# EAGLE design Spectra6PCB_71 (EAGLE 9.6.2)
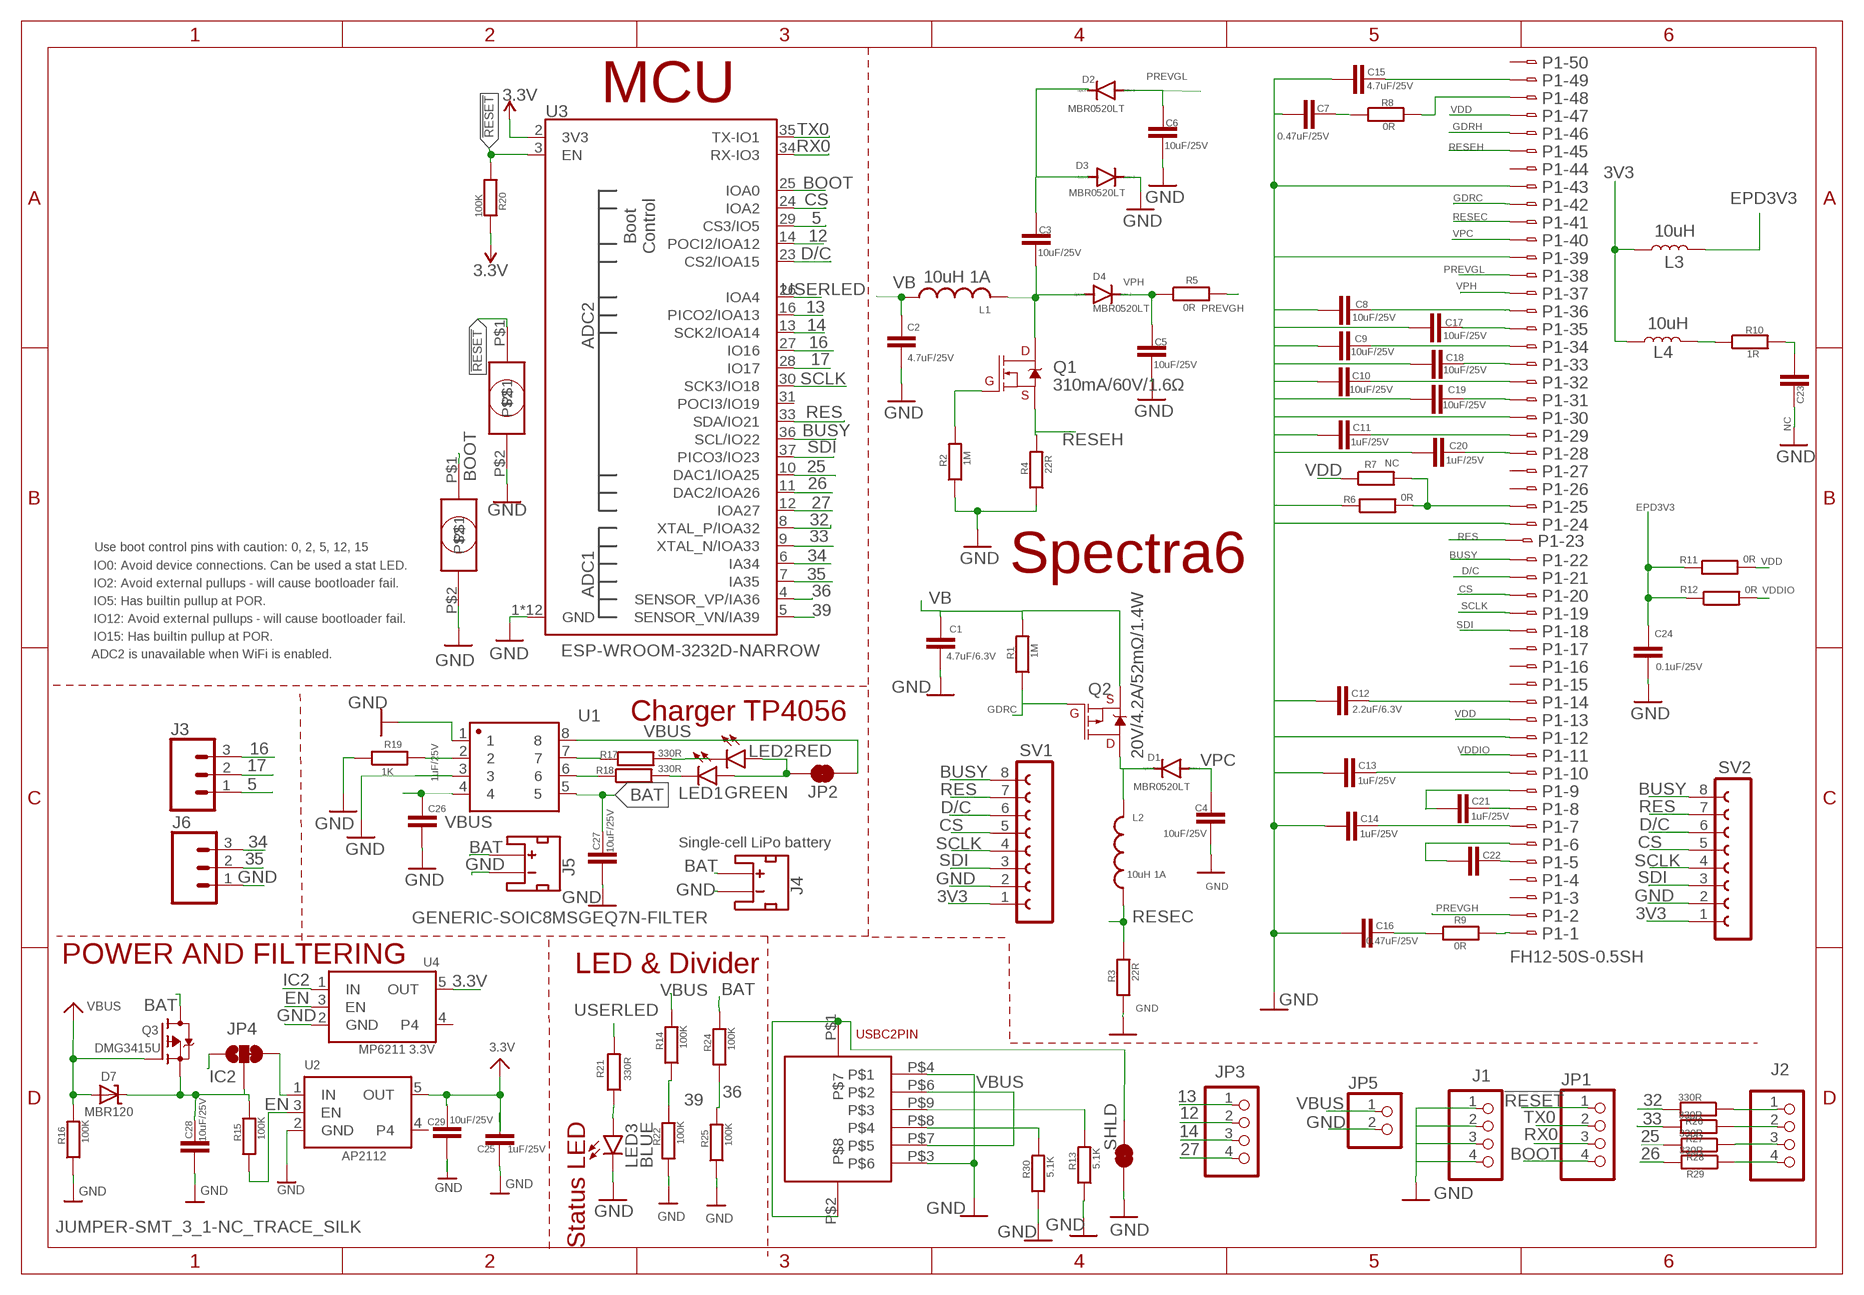
[diagram p0: schematic, sheet 1]

## Parts
C1  4.7uF/6.3V  C-EUC0805  [C0805]
C2  4.7uF/25V  C-EUC0805  [C0805]
C3  10uF/25V  C-EUC0805  [C0805]
C4  10uF/25V  C-EUC0805  [C0805]
C5  10uF/25V  C-EUC0805  [C0805]
C6  10uF/25V  C-EUC0805  [C0805]
C7  0.47uF/25V  C-EUC0805  [C0805]
C8  10uF/25V  C-EUC0805  [C0805]
C9  10uF/25V  C-EUC0805  [C0805]
C10  10uF/25V  C-EUC0805  [C0805]
C11  1uF/25V  C-EUC0805  [C0805]
C12  2.2uF/6.3V  C-EUC0805  [C0805]
C13  1uF/25V  C-EUC0805  [C0805]
C14  1uF/25V  C-EUC0805  [C0805]
C15  4.7uF/25V  C-EUC0805  [C0805]
C16  0.47uF/25V  C-EUC0805  [C0805]
C17  10uF/25V  C-EUC0805  [C0805]
C18  10uF/25V  C-EUC0805  [C0805]
C19  10uF/25V  C-EUC0805  [C0805]
C20  1uF/25V  C-EUC0805  [C0805]
C21  1uF/25V  C-EUC0805  [C0805]
C22  1uF/25V  C-EUC0805  [C0805]
C23  NC  C-EUC0805  [C0805]
C24  0.1uF/25V  C-EUC0805  [C0805]
C25  1uF/25V  C-EUC0805  [C0805]
C26  1uF/25V  C-EUC0805  [C0805]
C27  10uF/25V  C-EUC0805  [C0805]
C28  10uF/25V  C-EUC0805  [C0805]
C29  10uF/25V  C-EUC0805  [C0805]
D1  MBR0520LT  [SOD123]
D2  MBR0520LT  [SOD123]
D3  MBR0520LT  [SOD123]
D4  MBR0520LT  [SOD123]
D7  MBR120  DIODE-SCHOTTKYSOD-123  [SOD-123]
J1  PINHD-1X4  [1X04]
J2  PINHD-1X4  [1X04]
J3  CONN_03PAD  [1X03_SOLDER_PADS]
J4  JST_2MM_MALE  [JST-2-SMD]
J5  NC  JST_2MM_MALE  [JST-2-SMD]
J6  CONN_03PAD  [1X03_SOLDER_PADS]
JP1  PINHD-1X4  [1X04]
JP2  JUMPER-SMT_2_NC_TRACE_SILK  [SMT-JUMPER_2_NC_TRACE_SILK]
JP3  PINHD-1X4  [1X04]
JP4  JUMPER-SMT_3_1-NC_TRACE_SILK  [SMT-JUMPER_3_1-NC_TRACE_SILK]
JP5  PINHD-1X2  [1X02]
L1  10uH 1A  L-USL4035M  [L4035M]
L2  10uH 1A  L-USL4035M  [L4035M]
L3  10uH  INDUCTOR-0805-3.3UH  [0805]
L4  10uH  INDUCTOR-0805-3.3UH  [0805]
LED1  GREEN  LEDSML0805  [SML0805]
LED2  RED  LEDSML0805  [SML0805]
LED3  BLUE  LEDSML0805  [SML0805]
P1  FH12-50S-0.5SH  [FH12-50S-0.5SH]
Q1  310mA/60V/1.6Ω  MOSFET-NCH-2N7002PW  [SOT323]
Q2  20V/4.2A/52mΩ/1.4W  MOSFET_PCH-DMG2305UX-7  [SOT23-3]
Q3  DMG3415U  MOSFET-P  [SOT23-R]
R1  1M  R-EU_M0805  [M0805]
R2  1M  R-EU_M0805  [M0805]
R3  22R  R-EU_M0805  [M0805]
R4  22R  R-EU_M0805  [M0805]
R5  0R  R-EU_M0805  [M0805]
R6  0R  R-EU_M0805  [M0805]
R7  NC  R-EU_M0805  [M0805]
R8  0R  R-EU_M0805  [M0805]
R9  0R  R-EU_M0805  [M0805]
R10  1R  R-EU_M0805  [M0805]
R11  0R  R-EU_M0805  [M0805]
R12  0R  R-EU_M0805  [M0805]
R13  5.1K  R-EU_M0805  [M0805]
R14  100K  R-EU_M0805  [M0805]
R15  100K  R-EU_M0805  [M0805]
R16  100K  R-EU_M0805  [M0805]
R17  330R  R-EU_M0805  [M0805]
R18  330R  R-EU_M0805  [M0805]
R19  1K  R-EU_M0805  [M0805]
R20  100K  R-EU_M0805  [M0805]
R21  330R  R-EU_M0805  [M0805]
R22  100K  R-EU_M0805  [M0805]
R24  100K  R-EU_M0805  [M0805]
R25  100K  R-EU_M0805  [M0805]
R26  330R  R-EU_M0805  [M0805]
R27  330R  R-EU_M0805  [M0805]
R28  330R  R-EU_M0805  [M0805]
R29  330R  R-EU_M0805  [M0805]
R30  5.1K  R-EU_M0805  [M0805]
S3  TACTILE  [TACTILE]
S4  TACTILE  [TACTILE]
SHLD  SHLD  JUMPER-SMT_2_NC_TRACE_NO-SILK  [SMT-JUMPER_2_NC_TRACE_NO-SILK]
SV1  FE08-1  [FE08]
SV2  FE08-1  [FE08]
U1  GENERIC-SOIC8MSGEQ7N-FILTER  [SO08]
U2  AP2112  VREG_SOT23-5  [SOT23-5]
U3  ESP-WROOM-3232D-NARROW  [ESP-WROOM-32D-NARROW]
U4  MP6211 3.3V  VREG_SOT23-5  [SOT23-5]
U$4  USBC6PIN  [USBC6PIN]

## Nets
3.3V: C25.2 C29.2 R20.2 U2.5(OUT) U3.2(3V3) U4.5(OUT)
3V3: L3.1 L4.1 SV1.1 SV2.1
5: J3.1 U3.29(CS3/IO5)
12: JP3.2 U3.14(POCI2/IOA12)
13: JP3.1 U3.16(PICO2/IOA13)
14: JP3.3 U3.13(SCK2/IOA14)
16: J3.3 U3.27(IO16)
17: J3.2 U3.28(IO17)
25: R28.2 U3.10(DAC1/IOA25)
26: R29.2 U3.11(DAC2/IOA26)
27: JP3.4 U3.12(IOA27)
32: R26.2 U3.8(XTAL_P/IOA32)
33: R27.2 U3.9(XTAL_N/IOA33)
34: J6.3 U3.6(IA34)
35: J6.2 U3.7(IA35)
36: R24.1 R25.2 U3.4(SENSOR_VP/IA36)
39: R14.1 R22.2 U3.5(SENSOR_VN/IA39)
!RESET!: JP1.1 R20.1 S4.P$1 U3.3(EN)
BAT: C27.2 J4.2(+) J5.2(+) Q3.3(D) R24.2 U1.5
BOOT: JP1.4 S3.P$1 U3.25(IOA0)
BUSY: P1.22 SV1.8 SV2.8 U3.36(SCL/IO22)
CS: P1.20 SV1.5 SV2.5 U3.24(IOA2)
D/C: P1.21 SV1.6 SV2.6 U3.23(CS2/IOA15)
EN: R15.1 U2.3(EN) U4.3(EN)
EPD3V3: C24.2 L3.2 R11.1 R12.1
GDRC: P1.42 Q2.1(G) R1.1
GDRH: P1.46 Q1.1(G) R2.2
GND: C1.1 C2.1 C4.1 C5.2 C6.2 C7.1 C8.1 C9.1 C10.1 C11.1 C12.1 C13.1 C14.1 C15.1 C16.1 C17.1 C18.1 C19.1 C20.1 C23.2 C24.1 C25.1 C26.1 C27.1 C28.1 C29.1 D3.C J1.1 J1.2 J1.3 J1.4 J4.1(-) J5.1(-) J6.1 JP5.2 LED3.C P1.24 P1.30 P1.39 P1.43 R2.1 R3.1 R4.1 R6.1 R13.1 R16.1 R19.1 R22.1 R25.1 R30.1 S3.P$2 S4.P$2 SHLD.1 SV1.2 SV2.2 U1.1 U1.3 U2.2(GND) U3.1(GND) U3.15(GND) U3.38(GND) U3.GND1(GND) U3.GNDT1(GND) U3.GNDT2(GND) U3.GNDT3(GND) U3.GNDT4(GND) U3.GNDT5(GND) U3.GNDT6(GND) U3.GNDT7(GND) U3.GNDT8(GND) U4.2(GND) U$4.P$3 U$4.P$4
IC2: JP4.1 U4.1(IN)
LED1: LED2.C R17.2
LED2: LED1.C R18.2
N$1: C15.2 P1.49
N$2: P1.48 R8.2
N$3: C7.2 R8.1
N$4: L4.2 R10.1
N$5: C8.2 P1.36
N$6: C17.2 P1.35
N$7: C9.2 P1.34
N$8: C18.2 P1.33
N$9: C10.2 P1.32
N$10: C19.2 P1.31
N$12: C11.2 P1.29
N$13: C20.2 P1.28
N$14: P1.25 R6.2 R7.2
N$15: JP2.2 LED1.A LED2.A
N$16: C12.2 P1.14
N$17: C13.2 P1.10
N$18: C21.1 P1.9
N$19: C21.2 P1.8
N$20: C14.2 P1.7
N$21: C22.1 P1.6
N$22: C22.2 P1.5
N$23: P1.1 R9.2
N$24: C16.2 R9.1
N$25: C3.2 D4.A L1.2 Q1.3(D)
N$26: C3.1 D2.C D3.A
N$27: C23.1 R10.2
N$28: J2.1 R26.1
N$29: P1.12
N$30: J2.2 R27.1
N$31: D1.C L2.2 Q2.3(D)
N$32: J2.3 R28.1
N$33: C1.2 Q2.2(S) R1.2
N$34: R19.2 U1.2
N$35: JP4.3 U2.1(IN)
N$36: C28.2 D7.C JP4.2 Q3.2(S) R15.2
N$37: R18.1 U1.6
N$38: R17.1 U1.7
N$39: LED3.A R21.1
N$40: J2.4 R29.1
N$41: R30.2 U$4.P$8
N$42: R13.2 U$4.P$9
PREVGH: P1.2 R5.2
PREVGL: C6.1 D2.A P1.38
RES: P1.23 SV1.7 SV2.7 U3.33(SDA/IO21)
RESEC: L2.1 P1.41 R3.2
RESEH: P1.45 Q1.2(S) R4.2
RX0: JP1.3 U3.34(RX-IO3)
SCLK: P1.19 SV1.4 SV2.4 U3.30(SCK3/IO18)
SDI: P1.18 SV1.3 SV2.3 U3.37(PICO3/IO23)
SHLD: SHLD.2 U$4.P$1 U$4.P$2
TX0: JP1.2 U3.35(TX-IO1)
USERLED: R21.2 U3.26(IOA4)
VB: C2.2 L1.1
VBUS: C26.2 D7.A JP2.1 JP5.1 Q3.1(G) R14.2 R16.2 U1.4 U1.8 U$4.P$6 U$4.P$7
VDD: P1.13 P1.47 R7.1 R11.2
VDDIO: P1.11 R12.2
VPC: C4.2 D1.A P1.40
VPH: C5.1 D4.C P1.37 R5.1
Unconnected: J4.NC1(PAD1) J4.NC2(PAD2) J5.NC1(PAD1) J5.NC2(PAD2) P1.3 P1.4 P1.15 P1.16 P1.17 P1.26 P1.27 P1.44 P1.50 U2.4 U3.31(POCI3/IO19) U4.4

## Notes on the sheet
- MCU
- Use boot control pins with caution: 0, 2, 5, 12, 15
- IO0: Avoid device connections. Can be used a stat LED.
- Spectra6
- IO2: Avoid external pullups - will cause bootloader fail.
- IO5: Has builtin pullup at POR.
- IO12: Avoid external pullups - will cause bootloader fail.
- IO15: Has builtin pullup at POR.
- ADC2 is unavailable when WiFi is enabled.
- Charger TP4056
- Single-cell LiPo battery
- POWER AND FILTERING
- LED & Divider
- Status LED

## Library data of the parts
C1-C29 = rcl:C-EU: CAPACITOR, European symbol; SPICEPREFIX: C
D1-D4 = diode:MBR0520LT: SCHOTTKY BARRIER RECTIFIER Source: http://onsemi.com .. MBR0520LT1-D.pdf
D7 = microbuilder:DIODE-SCHOTTKY
J1 J2 JP1 JP3 = pinhead:PINHD-1X4: PIN HEADER
J3 J6 = SparkFun-Connectors:CONN_03: Multi connection point. Often used as Generic Header-pin footprint for 0.1 inch spaced/style header connections On any of the 0.1 inch spaced packages, you can populate with these: Break Away Headers - Straight <https://www.sparkfun.com/products/116> (PRT-00116) Break Away Male Headers - Right Angle <https://www.sparkfun.com/products/553> (PRT-00553) Female Headers <https://www.sparkfun.com/products/115> (PRT-00115) Break Away Headers - Machine Pin <https://www.sparkfun.com/products/117> (PRT-00117) Break Away Female Headers - Swiss Machine Pin <https://www.sparkfun.com/products/743> (PRT-00743) Stackable Header - 3 Pin (Female, 0.1") <https://www.sparkfun.com/products/13875> (PRT-13875) For SCREWTERMINALS and SPRING TERMINALS visit here: Screw Terimnals on SparkFun.com <https://www.sparkfun.com/search/results?term=Screw+Terminals> (5mm/3.5mm/2.54mm spacing) This device is also useful as a general connection point to wire up your design to another part of your project. Our various solder wires solder well into these plated through hole pads. Hook-Up Wire - Assortment (Stranded, 22 AWG) <https://www.sparkfun.com/products/11375> (PRT-11375) Hook-Up Wire - Assortment (Solid Core, 22 AWG) <https://www.sparkfun.com/products/11367> (PRT-11367) View the entire wire category on our website here <https://www.sparkfun.com/categories/141> Special notes: Molex polarized connector foot print use with SKU : PRT-08232 with associated crimp pins and housings.
J4 J5 = SparkFun-Connectors:JST_2MM_MALE: JST 2MM MALE RA CONNECTOR Two pin, compact surface mount connector. Commonly used as a battery input connection point. We really like the solid locking feeling and high current rating on these small connectors. We use these all the time as battery connectors. Mates to single-cell LiPo batteries. Here is the connector we sell at SparkFun: JST Right Angle Connector - White <https://www.sparkfun.com/products/8612> (PRT-08612) Datasheet <http://www.sparkfun.com/datasheets/Prototyping/Connectors/JST-Horizontal.pdf> It was used on these SparkFun products: SparkFun MOSFET Power Controller <https://www.sparkfun.com/products/11214> (PRT-11214) SparkFun Battery Babysitter - LiPo Battery Manager <https://www.sparkfun.com/products/13777> (PRT-13777) And many, many others that required a lipo battery connection.; PROD_ID: CONN-11443; SF_ID: PRT-08612
JP2 SHLD = SparkFun-Jumpers:JUMPER-SMT_2_NC_TRACE: Normally closed trace jumper This jumper has a trace between two pads so it's normally closed (NC). Use a razor knife to open the connection. For best results follow the IPC guidelines for cutting traces: Cutout at least 0.063 mm (0.005 in). Remove all loose material to clean up the cut area. Seal the cut with an approved epoxy. Reapply solder to reclose the connection.
JP4 = SparkFun-Jumpers:JUMPER-SMT_3_1-NC_TRACE: Normally closed trace jumper (1 of 2 connections) This jumper has a trace between two pads so it's normally closed (NC). The other connection is normally open (NO). Use a razor knife to open the connection. For best results follow the IPC guidelines for cutting traces: Cutout at least 0.063 mm (0.005 in). Remove all loose material to clean up the cut area. Seal the cut with an approved epoxy. Reapply solder to reclose the connection, or to close the NO connection.
JP5 = pinhead:PINHD-1X2: PIN HEADER
L1 L2 = rcl:L-US: INDUCTOR, American symbol; SPICEPREFIX: L
L3 L4 = SparkFun-Coils:INDUCTOR: Inductors Resist changes in electrical current. Basically a coil of wire. SparkFun Products: SparkFun Load Cell Amplifier - HX711 <https://www.sparkfun.com/products/13879> IOIO-OTG - V2.2 <https://www.sparkfun.com/products/13613>; PROD_ID: NDUC-13076; VALUE: 3.3µH/±20%/450mA
LED1-LED3 = led:LED: LED OSRAM: - CHIPLED LG R971, LG N971, LY N971, LG Q971, LY Q971, LO R971, LY R971 LH N974, LH R974 LS Q976, LO Q976, LY Q976 LO Q996 - Hyper CHIPLED LW Q18S LB Q993, LB Q99A, LB R99A - SideLED LS A670, LO A670, LY A670, LG A670, LP A670 LB A673, LV A673, LT A673, LW A673 LH A674 LY A675 LS A676, LA A676, LO A676, LY A676, LW A676 LS A679, LY A679, LG A679 - Hyper Micro SIDELED® LS Y876, LA Y876, LO Y876, LY Y876 LT Y87S - SmartLED LW L88C, LW L88S LB L89C, LB L89S, LG L890 LS L89K, LO L89K, LY L89K LS L896, LA L896, LO L896, LY L896 - TOPLED LS T670, LO T670, LY T670, LG T670, LP T670 LSG T670, LSP T670, LSY T670, LOP T670, LYG T670 LG T671, LOG T671, LSG T671 LB T673, LV T673, LT T673, LW T673 LH T674 LS T676, LA T676, LO T676, LY T676, LB T676, LH T676, LSB T676, LW T676 LB T67C, LV T67C, LT T67C, LS T67K, LO T67K, LY T67K, LW E67C LS E67B, LA E67B, LO E67B, LY E67B, LB E67C, LV E67C, LT E67C LW T67C LS T679, LY T679, LG T679 LS T770, LO T770, LY T770, LG T770, LP T770 LB T773, LV T773, LT T773, LW T773 LH T774 LS E675, LA E675, LY E675, LS T675 LS T776, LA T776, LO T776, LY T776, LB T776 LHGB T686 LT T68C, LB T68C - Hyper Mini TOPLED® LB M676 - Mini TOPLED Santana® LG M470 LS M47K, LO M47K, LY M47K Source: http://www.osram.convergy.de LUXEON: - LUMILED® LXK2-PW12-R00, LXK2-PW12-S00, LXK2-PW14-U00, LXK2-PW14-V00 LXK2-PM12-R00, LXK2-PM12-S00, LXK2-PM14-U00 LXK2-PE12-Q00, LXK2-PE12-R00, LXK2-PE12-S00, LXK2-PE14-T00, LXK2-PE14-U00 LXK2-PB12-K00, LXK2-PB12-L00, LXK2-PB12-M00, LXK2-PB14-N00, LXK2-PB14-P00, LXK2-PB14-Q00 LXK2-PR12-L00, LXK2-PR12-M00, LXK2-PR14-Q00, LXK2-PR14-R00 LXK2-PD12-Q00, LXK2-PD12-R00, LXK2-PD12-S00 LXK2-PH12-R00, LXK2-PH12-S00 LXK2-PL12-P00, LXK2-PL12-Q00, LXK2-PL12-R00 Source: www.luxeon.com KINGBRIGHT: KA-3528ASYC Source: www.kingbright.com
P1 = con-hirose:FH12-50S-0.5S: 0.5mm Pitch Connectors For FPC/FFC Source: Data sheet <http://www.hirose.co.jp/cataloge_hp/e58605370.pdf>; MPN: FH12-50S-0.5SH(55); OC_FARNELL: 1324557; OC_NEWARK: 34M6181
Q1 = SparkFun-DiscreteSemi:MOSFET-NCH: N-channel MOSFETs Voltage controlled devices that allow control of high current outputs. SparkFun Products: SparkFun OpenScale <https://www.sparkfun.com/products/13261> SparkFun Digital Sandbox <https://www.sparkfun.com/products/12651> SparkFun Monster Moto Shield <https://www.sparkfun.com/products/10182> SparkFun MOSFET Power Controller <https://www.sparkfun.com/products/11214>; PROD_ID: TRANS-11151
Q2 = SparkFun-DiscreteSemi:MOSFET_PCH: P-channel MOSFETs Voltage controlled devices that allow control of high current outputs. SparkFun Products: SparkFun ESP32 Thing <https://www.sparkfun.com/products/13907> SparkFun ESP8266 Thing <https://www.sparkfun.com/products/13231> SparkFun Pi Servo HAT V2 <https://www.sparkfun.com/products/15316> DMG2305UX-7 (20V/4.2A/SOT23-3); PROD_ID: TRANS-14388
Q3 = microbuilder:MOSFET-P: P-Channel Mosfet LEGEND VDS: Voltage Drain-Source ID: Drain Current RDS(ON): Drain-Source On-State Resistance VGS(TH): Gate-Source Threshold Voltage CISS: Drain-Source Input Capacitance SOT-23 Name VDS ID RDS(ON) VGS(TH) CISS Order Number IRLML5103 30V 760mA 600 mOhm -- 75pF @ 25V Digikey: IRLML5103PBFCT-ND IRLML6401 12V 4.3A 50 mOhm 950mV @ 250µA 830pF @ 10V Digikey: IRLML6401PBFTR-ND NTR0202PL 20V 400mA 800 mOhm 2.3V @ 250uA 70pF @ 5V Digikey: NTR0202PLT1GOSTR-ND NTR4101PT1G 20V 1.8A 85 mOhm 1.2V @ 250uA 675pF @ 10V Digikey: NTR4101PT1GOSCT-ND DMP2004K 20V 600mA 900 mOhm 1V @ 250uA 175pF @ 16V Digikey: DMP2004KDICT-ND PMV65XP 20V 3.9A 76 mOhm 950mV @ 1mA 725pF @ 20V Digikey: 568-2358-2-ND TO-252 Name VDS ID RDS(ON) VGS(TH) CISS Order Number AOD417 30V 25A 34 mOhm 3V @ 250µA 920pF @ 15V Digikey: 785-1106-2-ND PowerPak Name VDS ID RDS(ON) VGS(TH) CISS Order Number AON7401 30V 12A 14 mOhm 3V @ 250µA 2600pF @ 15V Digikey: 785-1302-1-ND
R1-R22 R24-R30 = rcl:R-EU_: RESISTOR, European symbol; SPICEPREFIX: R
S3 S4 = TACTILE1:TACTILE
SV1 SV2 = con-lsta:FE08-1: FEMALE HEADER; OC_FARNELL: unknown; OC_NEWARK: unknown
U1 = SparkFun-Retired:GENERIC-SOIC8: A placeholder for generic narrow & wide SOIC8 foorptints - used on the DIP adapter board. Has strange reference to IC-10141, a Seven Band Graphic Equalizer Display Filter SOIC-8 VFP: IC-10141; PROD_ID: IC-10141
U2 U4 = microbuilder:VREG_SOT23-5: SOT23-5 Fixed Voltage Regulators Part Current Out V Out V In V Dropout θJA (°C/W) TJ (°C) Digikey Part No. ADP121 150mA 3.3V 3.4-5.5V 0.09V @ 150mA -- -- ADP121-AUJZ33R7CT-ND ADP121 150mA 3.0V 3.1-5.5V 0.09V @ 150mA -- -- ADP121-AUJZ30R7CT-ND ADP122 300mA 3.3V 3.4-5.5V 0.085V @ 300mA -- -- ADP122AUJZ-3.3-R7CT-ND ADP1712 300mA 3.3V 3.5-5.5V 0.17V @ 300mA -- -- ADP1712AUJZ-3.3-R7TR-ND AP7311 (Low Cost) 150mA 3.3V 3.5-6V 0.15V @ 150mA -- -- AP7311-33WG-7DICT-ND LD39015M18R 150mA 1.8V 1.9V-5.5V 0.08V @ 100mA -- -- 497-6977-1-ND LP2985A-33DBVR 150mA 3.3V 3.3-16V 0.28V @ 150mA 206 150 296-18479-1-ND MCP1824T-3302E/OT 300mA 3.3V 3.5V-6V 0.2V @ 300mA -- -- MCP1824T-3302E/OTCT-ND MIC5205-2.5YM5 TR 150mA 2.5V 2.7-16V 0.165V @ 150mA -- -- 576-1257-2-ND MIC5205-3.0YM5 TR 150mA 3.0V 3.2V-16V 0.165V @ 150mA -- -- 576-1258-2-ND MIC5205-3.3YM5 TR 150mA 3.3V 3.5V-16V 0.165V @ 150mA -- -- 576-1259-2-ND TPS780330220 150mA 3.3V+2.2V 3.6-5.5V 250mV Max -- -- 296-23332-1-ND TDA3663/N1,135 100mA 3.3V 3.5-45V 0.18V @ 50mA -- -- 568-5343-1-ND Max operating temp can be calculated using θJA, TJ (max junction temperature), and power in watts. Set the "Maximum Ambient Temperature" until it reaches TJ ("Max Junction Temperature"), which is the absolute limit for safe use of the regulator: Heat Sink Temperature Calculator <http://www.daycounter.com/Calculators/Heat-Sink-Temperature-Calculator.phtml> For example, With 12V source into a 3.3V LP2985 and a 30mA load, we are dissipating (12V-3.3V) * 0.03A = 0.261W. With a θJA of 206 °C/W, a TJ of 150°C, and 261mW we can safely use the chip without a heat sink up to 75°C (=147.1°C Junction Temperature).
U3 = SparkFun-RF:ESP-WROOM-32: ESP-WROOM-32D - trace antenna (includes keepout) ESP-WROOM-32U - U.FL antenna connector Includes both "standard" footprints and "narrow" version (for use with tighter layouts).; PROD_ID: IC-15676
U$4 = USBC6PIN4:USBC6PIN

## Net classes
0 default: width 0.127 mm, drill 0.305 mm
1 power: width 0.305 mm, drill 0.305 mm

## Board
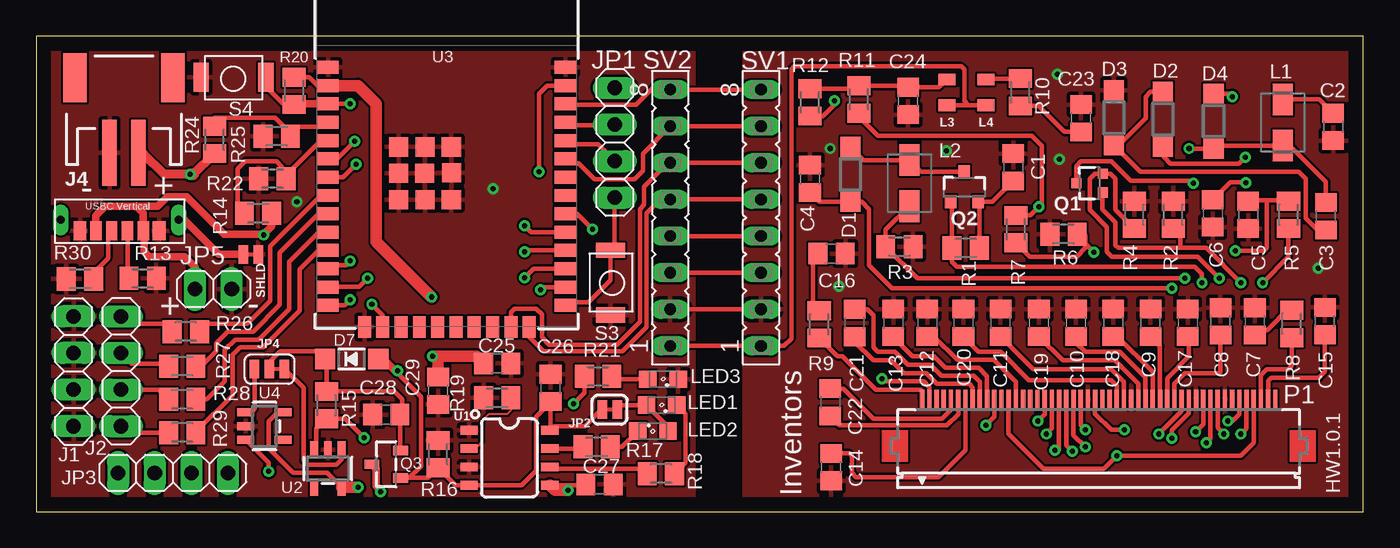
[diagram p1: board, top side]
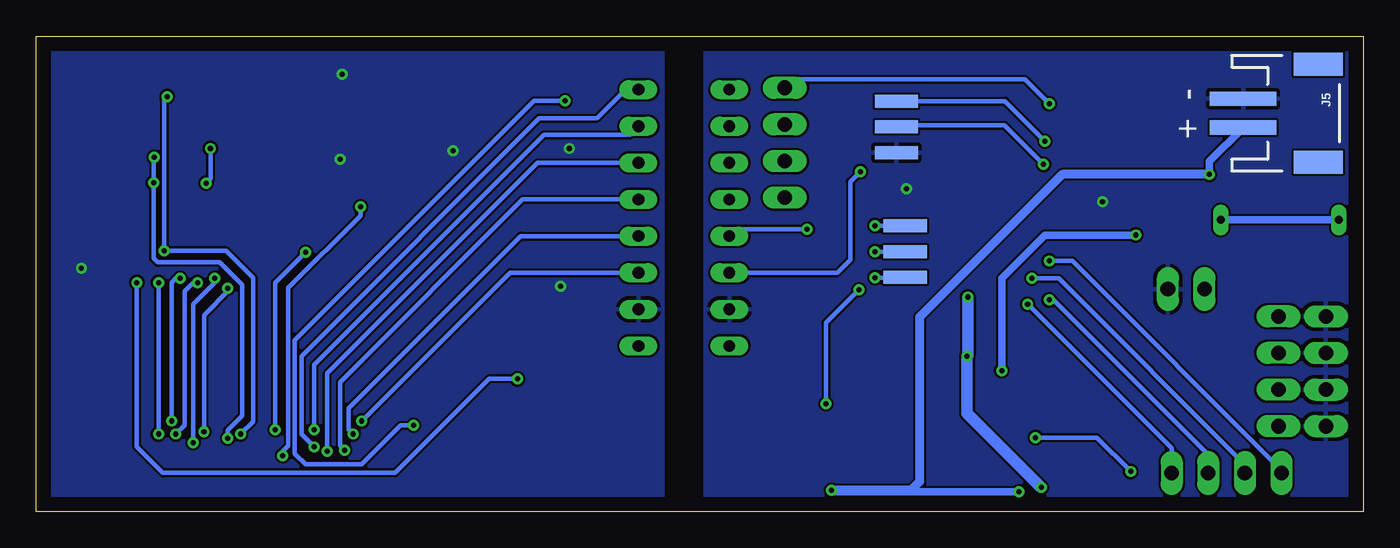
[diagram p2: board, bottom side, seen from below]

Size 92.1 x 33 mm. Coordinates in mm from the lower left corner, seen from the top.
Outline: 0,0 92.1,0 92.1,33 0,33 0,0
Copper layers (1*16): Top 0.035mm / dielectric 1.5mm / Bottom 0.035mm
Design rules "default *": minimum track width 6mil, minimum drill 0.35mm, track to track 6mil, track to pad 6mil, pad to pad 6mil, via to via 6mil, smd to smd 6mil, copper to edge 40mil, drill to drill 6mil, minimum pad ring 10mil, minimum via ring 8mil, stop-mask expansion 4mil, vias tented up to drill 0mil, thermal gap 10mil

### Footprints (pad centres in the part's own frame; a part is rotated, then mirrored left to right if it is on the bottom)
C0805 = smd 1.3 x 1.5: 1 -0.95,0; 2 0.95,0
SOD123 = smd 1.4 x 1.4: A 1.9,0; C -1.9,0
SOD-123 = smd 1.4 x 1.4: A 1.85,0; C -1.85,0
1X04 = drill 1.016 long: 1 -3.81,0; 2 -1.27,0; 3 1.27,0; 4 3.81,0
1X03_SOLDER_PADS = smd 3 x 0.9: 1 0,1.778; 2 0,0; 3 0,-1.778
JST-2-SMD = smd 1 x 4.6: 1 -1,-3.7; 2 1,-3.7 | smd 1.6 x 3.4: NC1 -3.4,1.5; NC2 3.4,1.5
SMT-JUMPER_2_NC_TRACE_SILK = smd 0.66 x 1.27: 1 -0.521,0; 2 0.521,0
SMT-JUMPER_3_1-NC_TRACE_SILK = smd 0.66 x 1.27: 1 -1.041,0; 2 0,0; 3 1.041,0
1X02 = drill 1.016 long: 1 -1.27,0; 2 1.27,0
L4035M = smd 2.2 x 1.4: 1 -1.6,0; 2 1.6,0
0805 = smd 0.8 x 1.2: 1 -0.9,0; 2 0.9,0
SML0805 = smd 1.2 x 1.2: A 1.05,0; C -1.05,0
FH12-50S-0.5SH = smd 0.3 x 1.3: 1 -12.25,3.25; 2 -11.75,3.25; 3 -11.25,3.25; 4 -10.75,3.25; 5 -10.25,3.25; 6 -9.75,3.25; 7 -9.25,3.25; 8 -8.75,3.25; 9 -8.25,3.25; 10 -7.75,3.25; 11 -7.25,3.25; 12 -6.75,3.25; 13 -6.25,3.25; 14 -5.75,3.25; 15 -5.25,3.25; 16 -4.75,3.25; 17 -4.25,3.25; 18 -3.75,3.25; 19 -3.25,3.25; 20 -2.75,3.25; 21 -2.25,3.25; 22 -1.75,3.25; 23 -1.25,3.25; 24 -0.75,3.25; 25 -0.25,3.25; 26 0.25,3.25; 27 0.75,3.25; 28 1.25,3.25; 29 1.75,3.25; 30 2.25,3.25; 31 2.75,3.25; 32 3.25,3.25; 33 3.75,3.25; 34 4.25,3.25; 35 4.75,3.25; 36 5.25,3.25; 37 5.75,3.25; 38 6.25,3.25; 39 6.75,3.25; 40 7.25,3.25; 41 7.75,3.25; 42 8.25,3.25; 43 8.75,3.25; 44 9.25,3.25; 45 9.75,3.25; 46 10.25,3.25; 47 10.75,3.25; 48 11.25,3.25; 49 11.75,3.25; 50 12.25,3.25
SOT323 = smd 0.7 x 0.7: 1 -0.65,-0.925; 2 0.65,-0.925; 3 0,0.925
SOT23-3 = smd 0.8 x 0.9: 1 -0.95,-1; 2 0.95,-1; 3 0,1.1
SOT23-R = smd 0.635 x 1.016: 1 -0.95,-1; 2 0.95,-1; 3 0,1
M0805 = smd 1.3 x 1.6: 1 -0.95,0; 2 0.95,0
TACTILE = smd 1.05 x 2: P$1 0,0; P$2 4.5,0
SMT-JUMPER_2_NC_TRACE_NO-SILK = smd 0.66 x 1.27: 1 -0.521,0; 2 0.521,0
FE08 = drill 0.813 long: 1 -8.89,0; 2 -6.35,0; 3 -3.81,0; 4 -1.27,0; 5 1.27,0; 6 3.81,0; 7 6.35,0; 8 8.89,0
SO08 = smd 0.6 x 1.2: 1 -1.905,-2.8; 2 -0.635,-2.8; 3 0.635,-2.8; 4 1.905,-2.8; 5 1.905,2.8; 6 0.635,2.8; 7 -0.635,2.8; 8 -1.905,2.8
SOT23-5 = smd 0.55 x 1.2: 1 -0.95,-1.3; 2 0,-1.3; 3 0.95,-1.3; 4 0.95,1.3; 5 -0.95,1.3
ESP-WROOM-32D-NARROW = smd 0.9 x 1.5: 1 6.43,8.238; 2 5.16,8.238; 3 3.89,8.238; 4 2.62,8.238; 5 1.35,8.238; 6 0.08,8.238; 7 -1.19,8.238; 8 -2.46,8.238; 9 -3.73,8.238; 10 -5,8.238; 11 -6.27,8.238; 12 -7.54,8.238; 13 -8.81,8.238; 14 -10.08,8.238; 25 -10.08,-8.238; 26 -8.81,-8.238; 27 -7.54,-8.238; 28 -6.27,-8.238; 29 -5,-8.238; 30 -3.73,-8.238; 31 -2.46,-8.238; 32 -1.19,-8.238; 33 0.08,-8.238; 34 1.35,-8.238; 35 2.62,-8.238; 36 3.89,-8.238; 37 5.16,-8.238; 38 6.43,-8.238 | smd 1.5 x 0.9: 15 -11.57,5.715; 16 -11.57,4.445; 17 -11.57,3.175; 18 -11.57,1.905; 19 -11.57,0.635; 20 -11.57,-0.635; 21 -11.57,-1.905; 22 -11.57,-3.175; 23 -11.57,-4.445; 24 -11.57,-5.715 | smd 1.33 x 1.33: GND1 -0.912,1.531; GNDT1 -2.751,3.346; GNDT2 -2.761,1.516; GNDT3 -2.751,-0.314; GNDT4 -0.891,-0.324; GNDT5 0.909,-0.314; GNDT6 0.909,1.516; GNDT7 0.909,3.346; GNDT8 -0.921,3.346
USBC6PIN = drill 0.55 pad 0.7 long: P$1 -4.05,0.25; P$2 4.15,0.25 | smd 0.89 x 1.3: P$3 2.8,1; P$4 -2.7,1 | smd 0.79 x 1.3: P$6 -1.6,1; P$7 1.7,1; P$8 0.6,1; P$9 -0.5,1

### Placement (x,y rotation side)
C1  67.8,23.9 270 top
C2  90,26.7 90 top
C3  89.5,20.5 90 top
C4  53.7,23.1 270 top
C5  84.1,20.6 270 top
C6  81.64,20.7 270 top
C7  84.56,13.21 270 top
C8  82.18,13.21 270 top
C9  77.32,13.11 270 top
C10  72.16,13.11 270 top
C11  66.92,13.11 270 top
C12  61.83,13.11 270 top
C13  59.48,13.11 270 top
C14  55.16,3.1 90 top
C15  89.43,13.23 270 top
C16  55.2,17.91 180 top
C17  79.9,13.11 270 top
C18  74.74,13.11 270 top
C19  69.58,13.11 270 top
C20  64.34,13.11 270 top
C21  56.79,13.1 270 top
C22  55.11,7.6 90 top
C23  72.5,27.3 90 top
C24  60.5,28.5 90 top
C25  32,10.3 180 top
C26  35.7,8.6 270 top
C27  39.1,1.9 180 top
C28  24.3,6.75 0 top
C29  27.9,8.4 90 top
D1  56.5,23.4 270 top
D2  78.19,27.23 270 top
D3  74.79,27.33 270 top
D4  81.7,27.1 270 top
D7  21.9,10.6 0 top
J1  2.6,9.75 90 top
J2  5.9,9.75 270 top
J3  31.8,18.05 0 bottom
J4  6.1,28.6 0 top
J5  4.65,27.65 270 bottom
J6  32.4,26.7 180 bottom
JP1  40.15,25.6 270 top
JP2  39.8,7.1 0 top
JP3  9.5,2.7 180 top
JP4  16.2,9.9 0 top
JP5  12.3,15.45 0 top
L1  86.5,27 270 top
L2  60.6,22.8 90 top
L3  63.2,29.1 90 top
L4  65.9,29.1 90 top
LED1  43.4,7.4 180 top
LED2  42.8,5.6 0 top
LED3  43.5,9.2 180 top
P1  73.73,4.57 0 top
Q1  73.1,22.8 90 top
Q2  64.4,22.5 0 top
Q3  24.3,3.3 90 top
R1  64.5,18.3 0 top
R2  78.9,20.6 270 top
R3  59.9,18.4 180 top
R4  76.2,20.6 270 top
R5  86.9,20.6 270 top
R6  71.29,19.26 0 top
R7  67.98,19.61 270 top
R8  87.12,13.03 270 top
R9  54.34,13 270 top
R10  68.3,29.1 270 top
R11  57.1,28.6 270 top
R12  53.7,28.4 270 top
R13  7.4,16.2 180 top
R14  15.4,20.7 0 top
R15  20.15,7.4 90 top
R16  27.9,4 270 top
R17  38.9,4.5 0 top
R18  43.35,2.65 0 top
R19  32,7.9 0 top
R20  17.9,29.2 90 top
R21  39,9.4 180 top
R22  16.4,23.1 0 top
R24  12.4,25.8 270 top
R25  16.7,26.05 0 top
R26  10.4,12.5 0 top
R27  10.15,10.1 0 top
R28  10.15,7.8 0 top
R29  10.15,5.5 0 top
R30  3.05,16.15 0 top
S3  39.85,18.15 270 top
S4  15.95,30.15 180 top
SHLD  14.9,17.85 180 top
SV1  50.3,20.4 90 top
SV2  44,20.4 90 top
U1  32.85,3.75 270 top
U2  20.25,3 180 top
U3  28.5,24.4 90 top
U4  15.85,5.95 270 top
U$4  5.85,20.5 180 top

### Tracks (layer width: path | path; a pad name or v marks a point on that pad's centre or on a via)
3.3V  (via drill 0.35)
  Top 0.305: C25.2 30.65,10.7 27.9,10.7 | U3.2 19.54,29.56 18.95,30.15 R20.2 | U4.5 16.75,6.9 16.15,6.3 16.15,4.4 17.85,2.7 20.2,2.7 U2.5
  Top 0.8: C29.2 27.9,10.7
  Top 0.813: U3.2 22.34,29.56 23.6,28.3 23.6,18.75 v27.45,14.9 | v27.5,10.8 30.55,10.8 C25.2 | v22.35,1.7 U2.5
  Bottom 0.508: v22.35,1.7 22.38,1.7
  Bottom 0.8: 27.5,6.82 22.38,1.7
  Bottom 0.813: v27.45,14.9 27.45,10.85 v27.5,10.8 27.5,6.82
3V3
  Top 0.305: L3.1 64.7,28.2 | 64.7,28.2 L4.1 | 64.7,28.2 64.4,28.5 64.4,30.7 64.2,30.9 52.6,30.9 52.4,30.7 52.4,12 51.91,11.51 SV1.1 SV2.1
5  (via drill 0.35)
  Top 0.305: U3.29 34.35,19.4 v33.9,19.85
  Bottom 0.305: v33.9,19.85 33.88,19.83 J3.1
12  (via drill 0.35)
  Top 0.305: U3.14 21.42,14.32 v21.8,14.7
  Bottom 0.305: v21.8,14.7 21.5,14.7 10.77,3.97 JP3.2
13  (via drill 0.35)
  Top 0.305: U3.16 24.05,13.64 v23.3,14.4
  Bottom 0.305: v23.3,14.4 13.31,4.41 JP3.1
14  (via drill 0.35)
  Top 0.305: U3.13 20.27,15.6 22.4,15.6 v23,16.2
  Bottom 0.305: v23,16.2 21.15,16.2 8.23,3.28 JP3.3
16  (via drill 0.35)
  Top 0.305: U3.27 34.51,16.86 v33.9,16.25
  Bottom 0.305: v33.9,16.25 31.82,16.25 J3.3
17  (via drill 0.35)
  Top 0.305: U3.28 33.98,18.13 v33.9,18.05
  Bottom 0.305: v33.9,18.05 J3.2
25
  Top 0.305: U3.10 19.6,19.4 17.55,17.35 17.55,14.05 15.45,11.95 13.8,11.95 13.1,11.25 13.1,9.05 11.85,7.8 R28.2
26
  Top 0.305: U3.11 20.18,18.21 19.69,18.21 18.3,16.83 18.3,13.95 15.75,11.4 14.15,11.4 13.65,10.9 13.65,8.1 11.12,5.58 11.2,5.5 | 11.25,5.45 11.2,5.5 | R29.2 11.2,5.5
27  (via drill 0.35)
  Top 0.305: U3.12 20.5,17.1 21.5,17.1 v21.8,17.4
  Bottom 0.305: v21.8,17.4 20.2,17.4 5.69,2.89 JP3.4
32
  Top 0.305: U3.8 19.74,21.94 16.24,18.44 16.24,14.64 14.65,13.05 11.7,13.05 11.35,12.7 R26.2
33
  Top 0.305: U3.9 20.18,20.75 19.69,20.75 16.9,17.97 16.9,14.35 15.05,12.5 13.3,12.5 12.5,11.7 12.5,11.15 11.45,10.1 R27.2
34  (via drill 0.35)
  Top 0.305: U3.6 20.88,24.48 v22.1,25.7
  Bottom 0.305: v22.1,25.7 24.88,28.48 J6.3
35  (via drill 0.35)
  Top 0.305: U3.7 21.31,23.21 v22.2,24.1
  Bottom 0.305: v22.2,24.1 24.9,26.8 32.3,26.8 J6.2
36
  Top 0.305: 20.24,27 U3.4 19.96,26.72 17.63,26.72 | 17.63,26.72 17.65,26.7 R25.2 | R24.1 12.4,27.35 16.6,27.35 17.23,26.72 17.63,26.72
39
  Top 0.305: U3.5 19.75,25.75 17.35,23.35 R22.2 17.05,23.4 17.05,23.95 16.7,24.3 14.5,24.3 14,23.8 14,21.05 R14.1
!RESET!  (via drill 0.35)
  Top 0.305: U3.3 v21.79,28.29 v21.8,28.3 | R20.1 17.2,28.25 15.95,29.5 S4.P$1
  Top 0.508: R20.1 17.94,28.29 U3.3
  Bottom 0.305: v21.8,28.3 23.5,30 39.56,30 JP1.1
BAT  (via drill 0.35)
  Top 0.305: U1.5 38.09,1.84 C27.2 | 7.35,24.85 7.3,24.9 J4.2
  Top 0.508: Q3.3 23.6,3 23.6,1.8 23.9,1.5 v23.9,1.39
  Top 0.61: R24.2 12.35,24.85 10.9,23.4 | v10.7,23.4 8.9,23.4 7.45,24.85 7.35,24.85
  Top 0.813: 10.9,23.4 v10.7,23.4 | v36.9,1.5 35.99,1.5 U1.5
  Bottom 0.508: v23.9,1.39 36.79,1.39 v36.9,1.5 | J5.2 10.7,24.3 v10.7,23.4
  Bottom 0.61: v10.7,23.4 20.9,23.4 30.8,13.5 30.8,2.1 31.4,1.5 v36.9,1.5
BOOT
  Top 0.305: U3.25 36.97,14.55 38.35,14.55 39.85,16.05 S3.P$1 40.15,18.45 JP1.4
BUSY  (via drill 0.35)
  Top 0.305: SV1.8 SV2.8 43.89,29.4 42.8,29.4 41.64,28.24 36.79,28.24 U3.36 | P1.22 71.98,5.32 v72.8,4.5 v72.81,4.5
  Bottom 0.305: 72.79,4.5 72.79,4.48 v72.81,4.5 73.69,5.38 73.69,10.8 57.19,27.3 53.19,27.3 51.2,29.29 SV1.8
CS  (via drill 0.35)
  Top 0.305: P1.20 70.98,4.28 v70.7,4.28 | SV1.5 SV2.5 43.33,21.67 42.36,20.7 42.36,12.81 40.69,11.14 35.21,11.14 34.21,12.14 U3.24
  Bottom 0.305: v70.7,4.28 71,4.58 71,9 58.33,21.67 SV1.5
D/C  (via drill 0.35)
  Top 0.305: P1.21 71.48,4.62 v71.9,4.2 | SV1.6 SV2.6 | U3.23 32.95,13.85 33.2,14.1 34.7,14.1 35.1,13.7 35.1,12.1 35.6,11.6 40.3,11.6 41.9,13.2 41.9,21 42.2,21.3 42.2,22.55 42.19,22.55 43.85,24.21 SV2.6 | SV2.6 44,23.7
  Bottom 0.305: v71.9,4.2 71.9,9.6 57.29,24.21 SV1.6
EN  (via drill 0.35)
  Top 0.305: U2.3 19.45,4.45 19.45,5.75 R15.1 21.45,6.45 v22.75,5.15 | U4.3 16.15,3.4 v16.15,2.8
  Bottom 0.305: v16.15,2.8 18.5,5.15 v22.75,5.15
EPD3V3
  Top 0.305: R12.1 56.9,29.35 R11.1 60.4,29.55 C24.2 62.65,29.45 L3.2
GDRC  (via drill 0.35)
  Top 0.305: P1.42 81.98,5.82 v82.4,5.4 | v80.9,15.9 80.9,16.5 80.4,17 63.9,17 63.55,17.35 R1.1 | R1.1 63.25,18.6 | Q2.1 63.55,21.4 R1.1
  Bottom 0.305: v82.4,5.4 81.8,6 81.8,15.3 81.2,15.9 v80.9,15.9
GDRH  (via drill 0.35)
  Top 0.305: P1.46 83.98,5.78 v83.6,5.4 | v83.6,15.9 81.2,18.3 79.4,18.3 | R2.2 79.4,19.15 79.4,18.3 | Q1.1 74,22.12 74,21 74.9,20.1 74.9,18.5 75.1,18.3 79.4,18.3
  Bottom 0.305: v83.6,5.4 v83.6,15.9
GND  (via drill 0.35)
  Top 0.305: SV1.2 SV2.2
  other vias: 55.1,25.2 18.1,21.5 31.7,22.4 63.15,25.05 70.85,30.35 71,24.45 55.7,15.65 88.95,16.9
  pour Top: -0.7,33.3 -0.7,-0.6 45.6,-0.6 45.6,33.3
  pour Bottom: -0.9,33.9 45.65,33.9 45.65,-1.2 -0.9,-1.2
  pour Bottom: 48.65,34.5 94.75,34.5 94.75,-0.6 48.65,-0.6
  pour Top: 49.15,33.95 49.15,0.05 93.5,0.05 93.5,33.95
IC2
  Top 0.305: JP4.1 15.16,7.16 14.9,6.9 U4.1
LED1
  Top 0.305: R17.2 40.65,4.5 LED2.C
LED2
  Top 0.305: LED1.C 45.05,6.79 45.05,3.4 R18.2
N$1
  Top 0.305: P1.49 85.48,9.08 85.7,9.3 89,9.3 89.43,9.73 C15.2
N$2
  Top 0.305: P1.48 84.98,9.48 85.4,9.9 86.9,9.9 87.12,10.12 R8.2
N$3
  Top 0.305: R8.1 86.96,14.14 85.42,12.6 84.9,12.6 C7.2
N$4
  Top 0.305: L4.2 65.95,30.05 R10.1
N$5
  Top 0.305: P1.36 78.98,8.88 79.7,9.6 82.1,9.6 82.18,9.68 C8.2
N$6
  Top 0.305: P1.35 78.48,9.28 80,10.8 80,12.06 C17.2
N$7
  Top 0.305: P1.34 77.98,11.5 C9.2
N$8
  Top 0.305: P1.33 77.48,9.72 75.04,12.16 C18.2
N$9
  Top 0.305: P1.32 76.98,9.32 75.2,11.1 72.8,11.1 72.16,11.74 C10.2
N$10
  Top 0.305: P1.31 76.48,8.87 74.85,10.5 71.24,10.5 C19.2
N$12
  Top 0.305: P1.29 75.48,9.02 74.6,9.9 69.2,9.9 66.94,12.16 C11.2
N$13
  Top 0.305: P1.28 74.98,8.76 74.6,9.14 68.9,9.14 66.94,11.1 65.4,11.1 C20.2 | C20.2 64.79,12.16 | C20.2 64.7,11.8
N$14  (via drill 0.35)
  Top 0.305: R7.2 68.94,17.7 72.2,17.7 72.8,18.3 72.8,18.6 | 72.8,18.6 72.8,19.2 72.74,19.26 R6.2 | P1.25 73.48,6.82 74.6,5.7 v75.5,5.7 | v73.4,18 72.8,18.6
  Bottom 0.305: v75.5,5.7 75.5,15.9 v73.4,18
N$15
  Top 0.305: JP2.2 40.62,7.4 LED1.A 43.85,5.9 LED2.A
N$16
  Top 0.305: P1.14 67.98,9.02 66.46,10.54 63.93,10.54 62.31,12.16 C12.2
N$17
  Top 0.305: P1.10 65.98,9.42 65.41,9.99 63.1,9.99 62.29,10.8 60.8,10.8 59.48,12.12 C13.2
N$18
  Top 0.305: P1.9 65.48,9.01 65.06,9.43 62.81,9.43 62.04,10.2 60.5,10.2 59.6,11.1 58.4,11.1 58.1,11.4 58.1,13.64 57.69,14.05 C21.1
N$19
  Top 0.305: P1.8 64.98,8.65 64.76,8.87 62.52,8.87 61.79,9.6 60.2,9.6 59.3,10.5 58.1,10.5 56.79,11.81 C21.2
N$20
  Top 0.305: P1.7 64.48,4.28 62.6,2.4 56.9,2.4 56.6,2.7 56.6,3.9 56.45,4.05 C14.2
N$21
  Top 0.305: P1.6 63.98,6.78 63.2,6 55.76,6 C22.1
N$22
  Top 0.305: C22.2 56.01,8.55 58.1,6.46 62.85,6.46 63.48,7.09 P1.5
N$23
  Top 0.305: P1.1 61.48,8.37 61.38,8.47 58.28,8.47 55.95,10.8 55.59,10.8 R9.2
N$24
  Top 0.305: C16.2 53.9,17.56 53.9,14.1 54.05,13.95 R9.1
N$25  (via drill 0.35)
  Top 0.305: C3.2 89.5,22.9 87.2,25.2 86.7,25.2 L1.2 81.9,25.4 D4.A v80,25.2 | v80.3,22.8 80.15,22.95 75.95,22.95 74.6,24.3 72.5,24.3 72.18,23.98 Q1.3
  Bottom 0.305: v80.3,22.8 80,23.1 v80,25.2
N$26
  Top 0.305: C3.1 88.9,19.55 88.1,20.35 88.1,23.1 87.6,23.6 76.62,23.6 D3.A 75.13,25.43 77,27.3 77,28.8 77.33,29.13 D2.C
N$27
  Top 0.305: C23.1 71.35,26.35 69.55,28.15 R10.2
N$28
  Top 0.305: J2.1 6.19,13.56 6.7,13.05 9.55,13.05 9.55,12.6 R26.1
N$30
  Top 0.305: R27.1 9.03,10.27 6.65,10.27 J2.2
N$31
  Top 0.305: D1.C 57.4,24.4 L2.2 61.4,23.6 Q2.3
N$32
  Top 0.305: J2.3 8.52,8.48 R28.1
N$33
  Top 0.305: 67.65,22.8 C1.2 66.35,21.5 Q2.2 65.45,21.4 R1.2
N$34
  Top 0.152: U1.2 30.26,4.6 30.7,4.6 30.95,4.85 30.95,6.3 31.45,6.8 32.7,6.8 32.95,7.05 R19.2
  Top 0.305: U1.2 30.15,4.49
N$35
  Top 0.305: JP4.3 18.55,8.59 18.55,3.55 18.85,3.25 20.81,3.25 21.2,3.64 U2.1
N$36
  Top 0.305: Q3.2 25.25,4.3 C28.2 25.4,6.9 25.4,7.8 24.85,8.35 R15.2 | R15.2 20.15,10.5 D7.C 19.5,11.15 16.95,11.15 16.2,10.4 JP4.2 | 19.75,8.35 R15.2
N$37
  Top 0.305: U1.6 35.77,3 42.05,3 R18.1
N$38
  Top 0.305: U1.7 37.84,4.38 R17.1
N$39
  Top 0.305: LED3.A 40.15,9.2 R21.1
N$40
  Top 0.305: R29.1 6.34,5.5 J2.4
N$41
  Top 0.305: U$4.P$8 5,19.25 5,17.6 4,16.6 R30.2
N$42
  Top 0.305: U$4.P$9 6.35,16.3 R13.2
PREVGH  (via drill 0.35)
  Top 0.305: v58.7,9.22 58.87,9.04 61.59,9.04 61.98,8.65 P1.2 | v85.1,15.9 86.9,17.7 R5.2
  Bottom 0.305: v58.7,9.22 60.68,9.22 67.2,2.7 83.3,2.7 85.1,4.5 v85.1,15.9
PREVGL  (via drill 0.35)
  Top 0.305: P1.38 79.98,6.83 78.8,5.65 v78.8,5.11 v78.81,5.1 | v83.95,22.82 83.9,22.87 82.86,22.87 C6.1 | v83.9,24.6 83.46,24.16 78.7,24.16 78.24,24.62 78.24,25.28 D2.A
  Bottom 0.305: v78.81,5.1 78.81,5.65 77.8,6.66 77.8,15.75 79.35,17.3 83.65,17.3 83.95,17.6 v83.95,22.82 | 83.95,22.9 v83.95,22.82 | v83.9,24.6 83.95,24.55 v83.95,22.82
RES  (via drill 0.35)
  Top 0.305: P1.23 72.48,6.02 v72.8,5.7 | SV1.7 SV2.7 42.1,24.85 42.1,23.65 41.53,23.08 38.74,23.08 37.64,24.18 37.04,24.18 U3.33
  Bottom 0.305: v72.8,5.7 72.8,10.2 56.85,26.15 50.9,26.15 SV1.7
RESEC  (via drill 0.35)
  Top 0.305: P1.41 81.48,5.08 v81.2,4.8 | v79.7,16.2 61.15,16.2 R3.2 58.95,19.55 L2.1
  Bottom 0.305: v81.2,4.8 81.2,14.4 79.7,15.9 v79.7,16.2
RESEH  (via drill 0.35)
  Top 0.305: P1.45 83.48,6.78 83,6.3 v82.7,6.3 | v82.1,16.2 80.6,17.7 74.65,17.7 74.3,18.05 74.3,19.75 73.1,20.95 73.1,23.1 73.45,23.45 Q1.2 74.55,23.45 74.9,23.1 74.9,20.95 R4.2
  Bottom 0.305: v82.7,6.3 82.7,15.9 82.4,16.2 v82.1,16.2
RX0
  Top 0.305: U3.34 36.99,25.5 38.98,25.5 JP1.3
SCLK  (via drill 0.35)
  Top 0.305: P1.19 70.48,6.59 70.48,6.58 70.48,5.78 v70.1,5.4 | SV1.4 SV2.4 | U3.30 37.53,20.67 v38.6,19.6
  Bottom 0.305: v70.1,5.4 70.4,5.7 70.4,7.2 58.47,19.13 SV1.4 | v38.6,19.6 43.53,19.6 SV2.4
SDI  (via drill 0.35)
  Top 0.305: P1.18 69.98,6.78 v69.5,6.3 | SV1.3 SV2.3 | U3.37 35.46,29.56 34.9,29 v34.9,23.6
  Bottom 0.305: v69.5,6.3 59.21,16.59 SV1.3 | v34.9,23.6 35.6,22.9 35.6,17.5 36.5,16.6 SV2.3
SHLD
  Top 0.508: U$4.P$1 10.27,20.25 12.67,17.85 SHLD.2
  Bottom 0.508: U$4.P$2 U$4.P$1
TX0
  Top 0.305: U3.35 36.94,26.82 40,26.82 40.05,26.87 JP1.2
USERLED  (via drill 0.35)
  Top 0.305: U3.26 35.19,15.59 v35,15.4 | v37.3,7.5 38.05,8.25 R21.2
  Bottom 0.305: v35,15.4 37.3,13.1 v37.3,7.5
VB
  Top 0.305: C2.2 89.05,28.6 L1.1
VBUS  (via drill 0.35)
  Top 0.305: 24.5,10.2 26.71,7.99 26.71,3.16 25.9,2.35 Q3.1 27.2,2.35 R16.2 29.1,1.84 U1.4 33.7,1.84 34.7,2.85 34.7,6.6 35.7,7.6 | 24.1,10.6 D7.A | C26.2 35.7,7.6 | JP2.1 39.24,7.1 38.08,5.94 35.94,5.94 U1.8 35.7,5.71 35.7,7.6
  Top 0.508: R14.2 16.35,19.8 15.8,19.25 | 15.8,19.25 v15.8,19.2 | v25.1,9.78 24.92,9.78 24.5,10.2 24.1,10.6 | U$4.P$7 4.15,20.55 4.8,21.2 6.95,21.2 | 6.95,21.2 7.45,20.7 U$4.P$6 7.5,19.45 7.5,18.05 7.85,17.7 10.3,17.7 11.03,16.97 JP5.1 | 6.95,21.2 8.45,21.2 9.1,21.85 10.45,21.85 13.05,19.25 15.8,19.25
  Bottom 0.305: 15.62,19.39 v15.8,19.2
  Bottom 0.508: v15.8,19.2 22.1,19.2 25.1,16.2 v25.1,9.78 25.1,9.7
VDD  (via drill 0.35)
  Top 0.305: P1.47 84.48,4.78 83.6,3.9 v74.98,3.9 74.08,3 69.9,3 67.48,5.42 P1.13 | R7.1 68.99,20.56 v69.58,21.15 69.8,21.37 69.8,25.4 69.1,26.1 58.4,26.1 57.1,27.4 R11.2
  Bottom 0.305: v69.58,21.15 69.58,20.55 74.6,15.53 74.6,4.58 74.98,4.2 v74.98,3.9
VDDIO  (via drill 0.35)
  Top 0.305: P1.11 66.48,6.58 v65.9,6 | R12.2 54.6,27.45 55.4,28.25 v55.4,28.5
  Bottom 0.305: v55.4,28.5 57.55,28.5 74.14,11.9 74.14,4.04 73.4,3.3 69.5,3.3 66.8,6 v65.9,6
VPC  (via drill 0.35)
  Top 0.305: P1.40 80.98,6.08 v80.45,5.55 | v78.8,15.52 59.38,15.52 57.8,17.1 57.8,21 57.3,21.5 D1.A 54.35,21.5 C4.2
  Bottom 0.305: v80.45,5.55 80.45,13.65 78.69,15.41 v78.8,15.52
VPH  (via drill 0.35)
  Top 0.305: P1.37 79.48,6.98 v77.9,5.4 | v83.22,18.1 85.2,18.1 85.4,18.3 85.4,21.6 | 85.4,21.6 86.85,21.6 R5.1 | 85.4,21.6 84.15,21.6 C5.1 | v83,28.8 82.8,29 D4.C
  Bottom 0.305: v77.9,5.4 77.05,6.25 77.05,16.25 78.9,18.1 v83.22,18.1 83.22,28.58 v83,28.8

### Text on the board
tPlace: - | + | - | + | Inventors | HW1.0.1
bPlace: - | +
tNames: S4 | S3